# Altium schematic sheet sensor.SchDoc
size A4
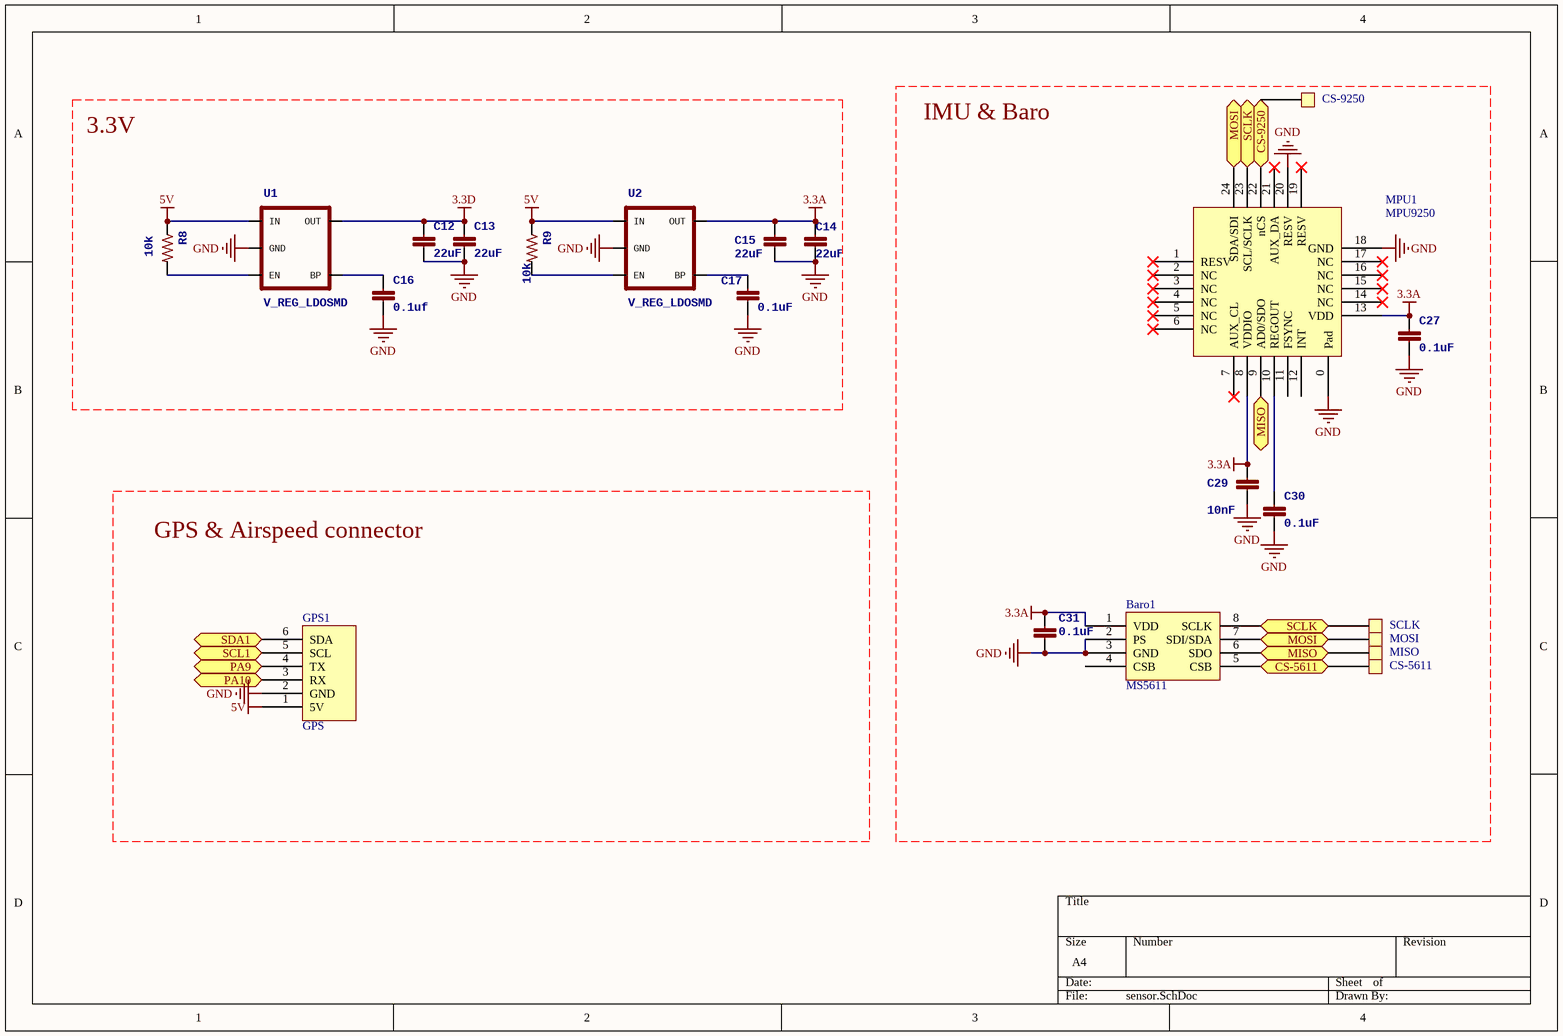
[diagram p0: sensor.SchDoc]

## Parts
Baro1  MS5611  [MS5611]
C12  22uF  [0805]
C13  22uF  [0805]
C14  22uF  [0805]
C15  22uF  [0805]
C16  0.1uf  [0402]
C17  0.1uF  [0402]
C27  0.1uF  [0402]
C29  10nF  [0402]
C30  0.1uF  [0402]
C31  0.1uF  [0402]
CS-5611  TestPad  [TestPad]  (value not drawn)
CS-9250  TestPad  [TestPad]  (value not drawn)
GPS1  GPS  [WFRSM125]
MISO  TestPad  [TestPad]  (value not drawn)
MOSI  TestPad  [TestPad]  (value not drawn)
MPU1  MPU9250  [MPU9250]
R8  10k  [0402]
R9  10k  [0402]
SCLK  TestPad  [TestPad]  (value not drawn)
U1  V_REG_LDOSMD  [SOT23-5]
U2  V_REG_LDOSMD  [SOT23-5]

## Ports
CS-5611, CS-9250, MISO, MOSI, PA9, PA10, SCL1, SCLK, SDA1

## Nets
3.3A: Baro1.1(VDD) C14.1 C15.1 C27.1 C29.1 C31.1 MPU1.8(VDDIO) MPU1.13(VDD) U2.5(OUT)
3.3D: C12.1 C13.1 U1.5(OUT)
5V: GPS1.1(5V) R8.1 R9.1 U1.1(IN) U2.1(IN)
GND: Baro1.2(PS) Baro1.3(GND) C12.2 C13.2 C14.2 C15.2 C16.2 C17.2 C27.2 C29.2 C30.2 C31.2 GPS1.2(GND) MPU1.0(Pad) MPU1.18(GND) MPU1.20(RESV) U1.2(GND) U2.2(GND)
CS-5611: Baro1.5(CSB) CS-5611.1 ; port CS-5611
CS-9250: CS-9250.1 MPU1.22(nCS) ; port CS-9250
MISO: Baro1.6(SDO) MISO.1 MPU1.9(AD0/SDO) ; port MISO
MOSI: Baro1.7(SDI/SDA) MOSI.1 MPU1.24(SDA/SDI) ; port MOSI
PA9: GPS1.4(TX) ; port PA9
PA10: GPS1.3(RX) ; port PA10
SCL1: GPS1.5(SCL) ; port SCL1
SCLK: Baro1.8(SCLK) MPU1.23(SCL/SCLK) SCLK.1 ; port SCLK
SDA1: GPS1.6(SDA) ; port SDA1
NetC16_1: C16.1 U1.4(BP)
NetC17_1: C17.1 U2.4(BP)
NetC30_1: C30.1 MPU1.10(REGOUT)
NetR8_2: R8.2 U1.3(EN)
NetR9_2: R9.2 U2.3(EN)

Not connected (* = marked no-connect by the designer): Baro1 4(CSB); MPU1 1(RESV)* 2(NC)* 3(NC)* 4(NC)* 5(NC)* 6(NC)* 7(AUX_CL)* 11(FSYNC) 12(INT) 14(NC)* 15(NC)* 16(NC)* 17(NC)* 19(RESV)* 21(AUX_DA)*

## Notes on the sheet
- 3.3V
- IMU & Baro
- GPS & Airspeed connector

## Library data of the parts
C12-C17 C27 C29-C31 = CAP0402-CAP: <b>Capacitor</b> / Standard 0603 ceramic capacitor, and 0.1" leaded capacitor.; PARTNO: CC0402ZRY5V7BB104
R8 R9 = RESISTOR0402-RES: <b>Resistor</b> / Basic schematic elements and footprints for 0603, 1206, and PTH resistors.
U1 U2 = V_REG_LDOSMD: <b>Voltage Regulator LDO</b> / Standard 150mA LDO voltage regulator in SOT-23 layout. Micrel part MIC5205. BP (by-pass) pin is used to lower output noise with 470pF cap.; PARTNO: MIC5207-3.3YM5